# Altium schematic sheet Sheet1.SchDoc
size A4
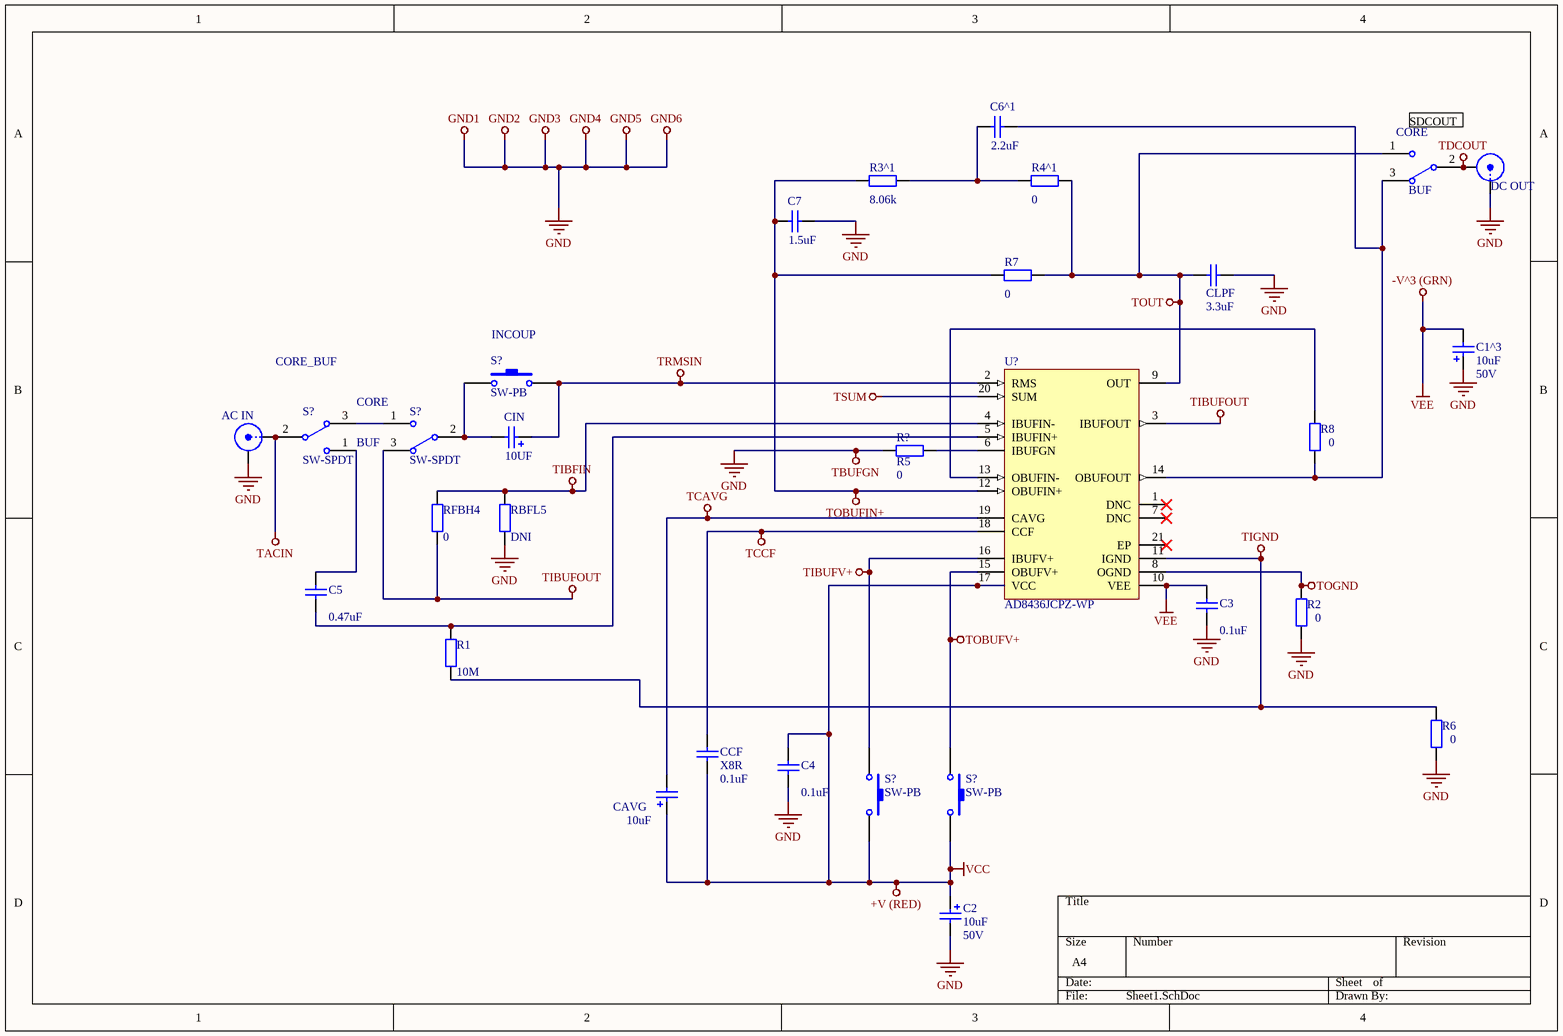
[diagram p0: Sheet1.SchDoc]

## Parts
(Parts that share a designator on the sheet are numbered #1, #2 ... from top to bottom, then left to right.)
#1  DC OUT  [BNC_RA CON]
#2  AC IN  [BNC_RA CON]
C1^3  10uF  value 50V  [POLAR0.8]
C2  10uF  value 50V  [POLAR0.8]
C3  value 0.1uF  [RAD-0.3]  (hidden comment: Cap)
C4  value 0.1uF  [RAD-0.3]  (hidden comment: Cap)
C5  value 0.47uF  [RAD-0.3]  (hidden comment: Cap)
C6^1  value 2.2uF  [RAD-0.3]  (hidden comment: Cap)
C7  value 1.5uF  [RAD-0.3]  (hidden comment: Cap)
C?#1  CLPF  value 3.3uF  [RAD-0.3]
C?#2  CAVG  value 10uF  [POLAR0.8]
CCF  X8R  value 0.1uF  [RAD-0.3]
CIN  value 10UF  [POLAR0.8]  (hidden comment: Cap Pol2)
CORE  BUF  [TL36WW15050]
R1  value 10M  [AXIAL-0.4]  (hidden comment: Res2)
R2  value 0  [AXIAL-0.4]
R3^1  value 8.06k  [AXIAL-0.4]
R4^1  value 0  [AXIAL-0.4]
R6  value 0  [AXIAL-0.4]
R7  value 0  [AXIAL-0.4]
R8  value 0  [AXIAL-0.4]
R?  R5  value 0  [AXIAL-0.4]
RBFL5  value DNI  [AXIAL-0.4]  (hidden comment: Res2)
RFBH4  value 0  [AXIAL-0.4]  (hidden comment: Res2)
S?#1  SW-PB  [SPST-2]
S?#2  SW-SPDT  [TL36WW15050]
S?#3  SW-SPDT  [TL36WW15050]
S?#4  SW-PB  [SPST-2]
S?#5  SW-PB  [SPST-2]
U?  AD8436JCPZ-WP  [ADI-CP-20-10_M]

## Nets
+V (RED): C2.1 C4.2 C?#2.1 CCF.1 S?#4.2 S?#5.2 U?.17(VCC)  [also labelled VCC]
-V^3 (GRN): C1^3.2 C3.2 U?.10(VEE)  [also labelled VEE]
GND: #1.1(X) #2.2(Y) C1^3.1 C2.2 C3.1 C4.1 C7.1 C?#1.1 R2.2 R6.2 R?.1 RBFL5.2  [also labelled GND1, GND2, GND3, GND4, GND5, GND6, TBUFGN]
TACIN: #2.1(X) S?#2.2
TCAVG: C?#2.2 U?.19(CAVG)
TCCF: CCF.2 U?.18(CCF)
TDCOUT: #1.2(Y) CORE.2
TIBFIN: RBFL5.1 RFBH4.1 U?.4(IBUFIN-)
TIBUFOUT: RFBH4.2 S?#3.3 U?.3(IBUFOUT)
TIBUFV+: S?#4.1 U?.16(IBUFV+)
TIGND: R1.2 R6.1 U?.11(IGND)
TOBUFIN+: C7.2 R3^1.2 R7.2 U?.12(OBUFIN+)
TOBUFV+: S?#5.1 U?.15(OBUFV+)
TOGND: R2.1 U?.8(OGND)
TOUT: C?#1.2 CORE.1 R4^1.1 R7.1 U?.9(OUT)
TRMSIN: CIN.1 S?#1.2 U?.2(RMS)
TSUM: U?.20(SUM)
NetC5_1: C5.1 R1.1 U?.5(IBUFIN+)
NetC5_2: C5.2 S?#2.1
NetC6^1_1: C6^1.1 CORE.3 R8.2 U?.14(OBUFOUT)
NetC6^1_2: C6^1.2 R3^1.1 R4^1.2
NetCIN_2: CIN.2 S?#1.1 S?#3.2
NetR8_1: R8.1 U?.13(OBUFIN-)
NetR?_2: R?.2 U?.6(IBUFGN)
NetS?#2_3: S?#2.3 S?#3.1

Not connected (* = marked no-connect by the designer): U? 1(DNC)* 7(DNC)* 21(EP)*

## Notes on the sheet
- SDCOUT
- CORE_BUF
- (near S?#1) INCOUP
- (near S?#2) CORE
- (near S?#2) BUF

## Library data of the parts
#1 #2 = BNC: BNC Elbow Connector; LatestRevisionDate: 17-Jul-2002; LatestRevisionNote: Re-released for DXP Platform.; Publisher: Altium Limited
C1^3 C2 C?#2 CIN = Cap Pol2: Polarized Capacitor (Axial); Published: 8-Jun-2000; LatestRevisionDate: 17-Jul-2002; LatestRevisionNote: Re-released for DXP Platform.; PackageReference: POLAR0.8; Publisher: Altium Limited; PackageDescription: Polarized Capacitor; 2 Leads
C3-C5 C6^1 C7 C?#1 CCF = Cap: Capacitor; Published: 8-Jun-2000; LatestRevisionDate: 17-Jul-2002; LatestRevisionNote: Re-released for DXP Platform.; PackageReference: RAD-0.3; Publisher: Altium Limited; PackageDescription: Radial Cap, Thru-Hole; 2 Leads; 0.3 in Pin Spacing
CORE S?#2 S?#3 = SW-SPDT: SPDT Subminiature Toggle Switch, Right Angle Mounting, Vertical Actuation; Published: 24-Mar-1999; LatestRevisionDate: 17-Dec-2003; LatestRevisionNote: Schematic revised, PCB Footprint replaced.; DatasheetVersion: 05-Dec-2000; PackageReference: TL36WW15050; Publisher: Altium Limited; PackageDescription: Switch; 4 Leads; ComponentLink1Description: Manufacturer Link; ComponentLink1URL: http://www.apem.com
R1 R2 R3^1 R4^1 R6-R8 R? RBFL5 RFBH4 = Res2: Resistor; Published: 8-Jun-2000; LatestRevisionDate: 17-Jul-2002; LatestRevisionNote: Re-released for DXP Platform.; PackageReference: AXIAL-0.4; Publisher: Altium Limited; PackageDescription: Axial Device, Thru-Hole; 2 Leads; 0.4 in Pin Spacing
S?#1 S?#4 S?#5 = SW-PB: Switch; Published: 24-Mar-1999; LatestRevisionDate: 17-Jul-2002; LatestRevisionNote: Re-released for DXP Platform.; PackageReference: SPST-2; Publisher: Altium Limited; PackageDescription: Switch; 2 Leads
U? = CMP-0527-00005-3: Low Cost, Low Power, True RMS-to-DC Converter, 4.8 to 36 V Single Supply, 0 to 70 degC, 20-Pin QFN (CP-20-10); Manufacturer: Analog Devices; -3dB Bandwidth: 950 KHz; Max Vin (V-rms): 3 V rms; Supply Current: 300 uA; V Span (max): 36 V; Error (%@ CF: 3)=0.5; V Span (min): 4.8 V; ComponentLink3URL: http://www.analog.com/static/imported-files/packages/PKG_PDF/LFCSP(CP)/CP_20_10.pdf; ComponentLink1URL: http://www.analog.com/; ComponentLink3Description: Package Specification; PackageVersion: Rev. B; PackageReference: CP-20-10; RoHS: TRUE; ComponentLink2Description: Datasheet; ComponentLink1Description: Manufacturer URL; PackageDescription: 20-Pin Frame Chip Scale Package, Body 4 x 4 mm, Pitch 0.5 mm; DatasheetVersion: Rev. B; Operating Temperature Range: 0 to 70 degC; Mounting Technology: Surface Mount; ComponentLink2URL: http://www.analog.com/static/imported-files/data_sheets/AD8436.pdf; PartNumber: AD8436JCPZ-WP